# EAGLE design ethernet-cp2200 (EAGLE 7.4.0)
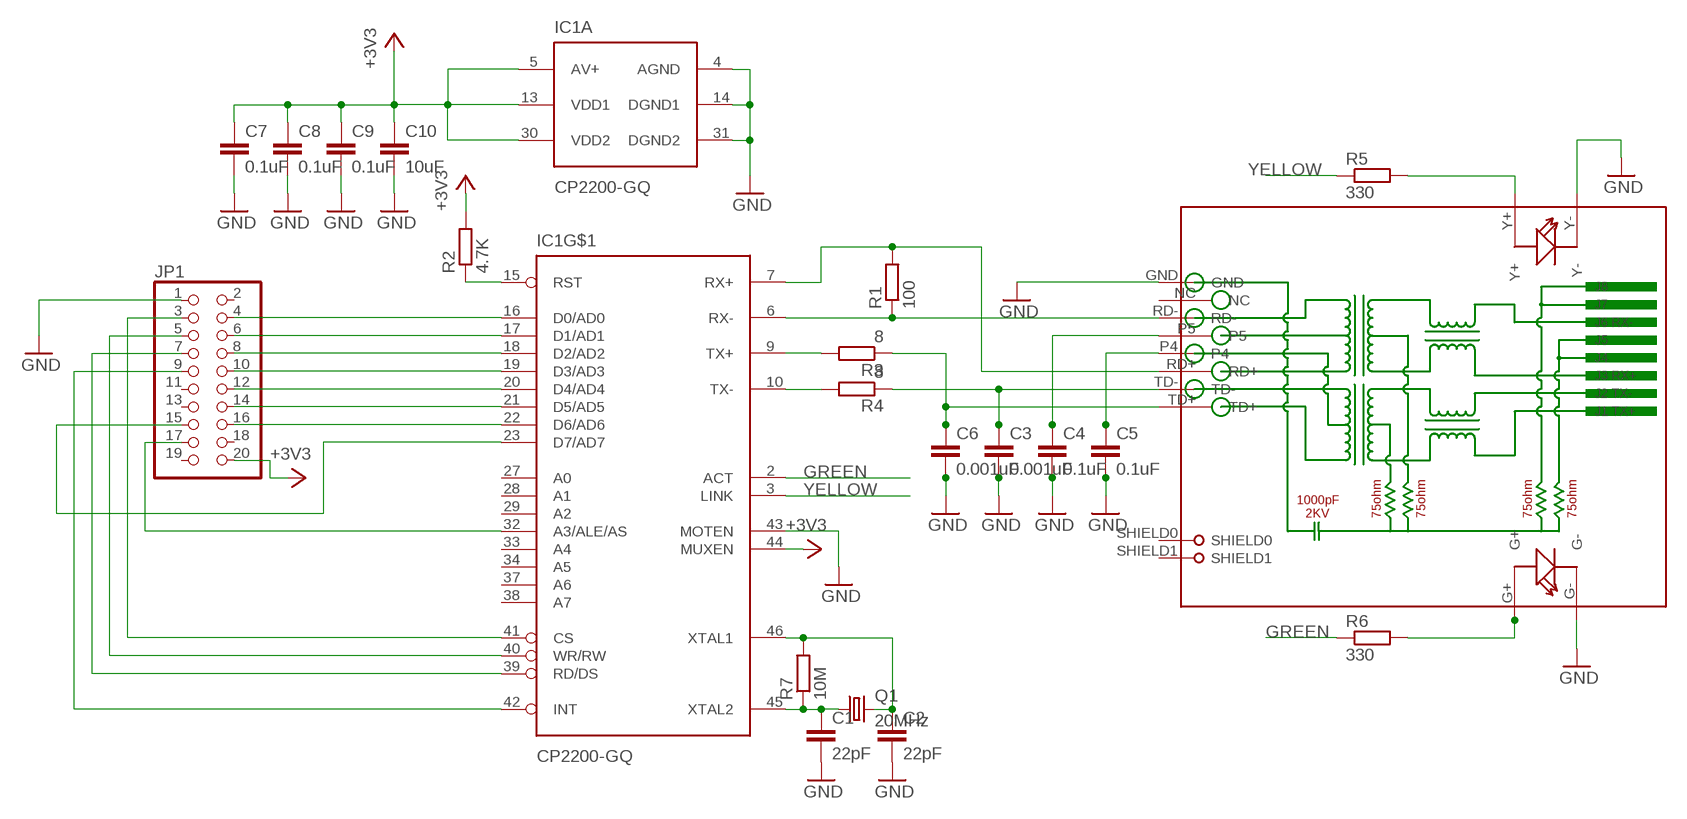
[diagram p0: schematic, sheet 1]

## Parts
C1  22pF  C-EUC0805  [C0805]
C2  22pF  C-EUC0805  [C0805]
C3  0.001uF  C-EUC0805  [C0805]
C4  0.1uF  C-EUC0805  [C0805]
C5  0.1uF  C-EUC0805  [C0805]
C6  0.001uF  C-EUC0805  [C0805]
C7  0.1uF  C-EUC0805  [C0805]
C8  0.1uF  C-EUC0805  [C0805]
C9  0.1uF  C-EUC0805  [C0805]
C10  10uF  C-EUC0805  [C0805]
IC1  CP2200-GQ  [TQFP-48]
JP1  PINHD-2X10  [2X10]
Q1  20MHz  CRYSTALHC49S  [HC49/S]
R1  100  R-EU_M0805  [M0805]
R2  4.7K  R-EU_M0805  [M0805]
R3  8  R-EU_M0805  [M0805]
R4  8  R-EU_M0805  [M0805]
R5  330  R-EU_M0805  [M0805]
R6  330  R-EU_M0805  [M0805]
R7  10M  R-EU_M0805  [M0805]
RJ1  HR911105A  [HR911105A]

## Nets
+3V3: C7.1 C8.1 C9.1 C10.1 IC1.5(A:AV+) IC1.13(A:VDD1) IC1.30(A:VDD2) IC1.44(MUXEN) JP1.20 R2.2
GND: C1.2 C2.2 C3.2 C4.2 C5.2 C6.2 C7.2 C8.2 C9.2 C10.2 IC1.4(A:AGND) IC1.14(A:DGND1) IC1.31(A:DGND2) IC1.43(MOTEN) JP1.1 RJ1.G- RJ1.GND RJ1.Y-
GREEN: IC1.2(ACT) R6.1
N$1: C2.1 IC1.46(XTAL1) Q1.2 R7.2
N$2: C1.1 IC1.45(XTAL2) Q1.1 R7.1
N$4: IC1.6(RX-) R1.1 RJ1.RD-
N$5: IC1.7(RX+) R1.2 RJ1.RD+
N$6: IC1.9(TX+) R3.2
N$7: C6.1 R3.1 RJ1.TD+
N$8: IC1.10(TX-) R4.2
N$9: R5.2 RJ1.Y+
N$10: R6.2 RJ1.G+
N$11: IC1.32(A3/ALE/AS) JP1.17
N$12: C3.1 R4.1 RJ1.TD-
N$13: IC1.16(D0/AD0) JP1.4
N$14: C5.1 RJ1.P4
N$15: C4.1 RJ1.P5
N$16: IC1.17(D1/AD1) JP1.6
N$18: IC1.18(D2/AD2) JP1.8
N$19: IC1.19(D3/AD3) JP1.10
N$20: IC1.20(D4/AD4) JP1.12
N$21: IC1.21(D5/AD5) JP1.14
N$22: IC1.22(D6/AD6) JP1.16
N$23: IC1.23(D7/AD7) JP1.15
N$25: IC1.41(CS) JP1.3
N$26: IC1.40(WR/RW) JP1.5
N$27: IC1.39(RD/DS) JP1.7
N$28: IC1.42(INT) JP1.9
N$29: IC1.15(RST) R2.1
YELLOW: IC1.3(LINK) R5.1
Unconnected: IC1.1(N:NC1) IC1.8(N:NC2) IC1.11(N:NC3) IC1.12(N:NC4) IC1.24(N:NC5) IC1.25(N:NC6) IC1.26(N:NC7) IC1.27(A0) IC1.28(A1) IC1.29(A2) IC1.33(A4) IC1.34(A5) IC1.35(N:NC8) IC1.36(N:NC9) IC1.37(A6) IC1.38(A7) IC1.47(N:NC10) IC1.48(N:NC11) JP1.2 JP1.11 JP1.13 JP1.18 JP1.19 RJ1.NC RJ1.SHIELD0 RJ1.SHIELD1

## Library data of the parts
C1-C10 = resistor:C-EU: CAPACITOR, European symbol
IC1 = silabs-eth:CP2200-GQ: SINGLE-CHIP ETHERNET CONTROLLER The CP2200 has an IEEE 802.3 compliant 10 BASE-T Ethernet
JP1 = SparkFun-Connectors:PINHD-2X10: PIN HEADER
Q1 = crystal:CRYSTAL: CRYSTAL; OC_FARNELL: 1667008; OC_NEWARK: unknown
R1-R7 = resistor:R-EU_: RESISTOR, European symbol
RJ1 = CONNECTER:HR911105A

## Board
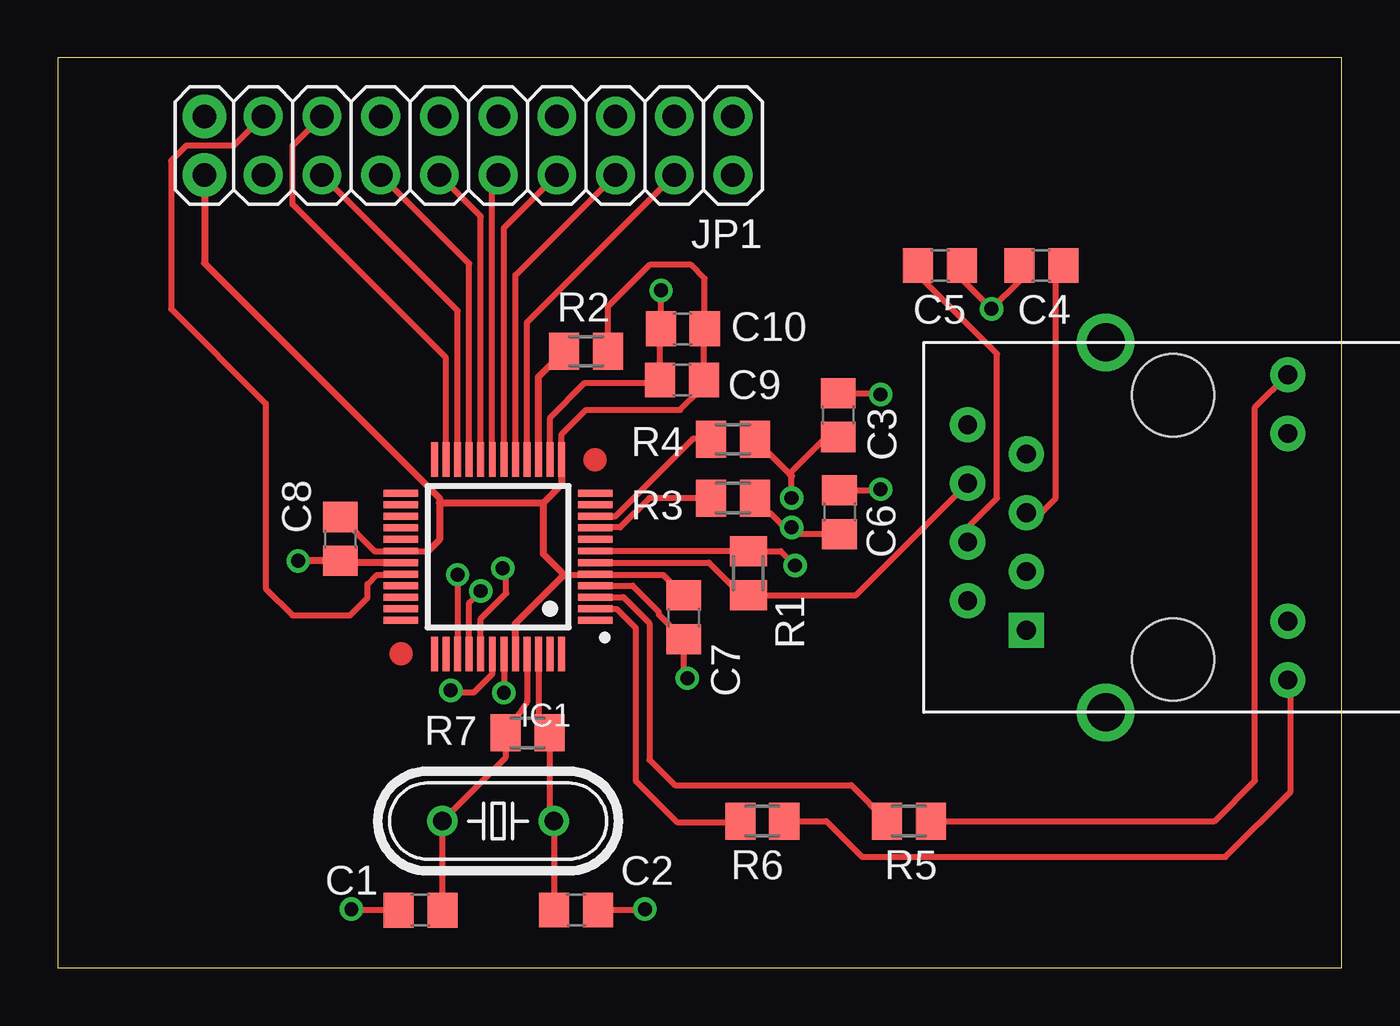
[diagram p1: board, top side]
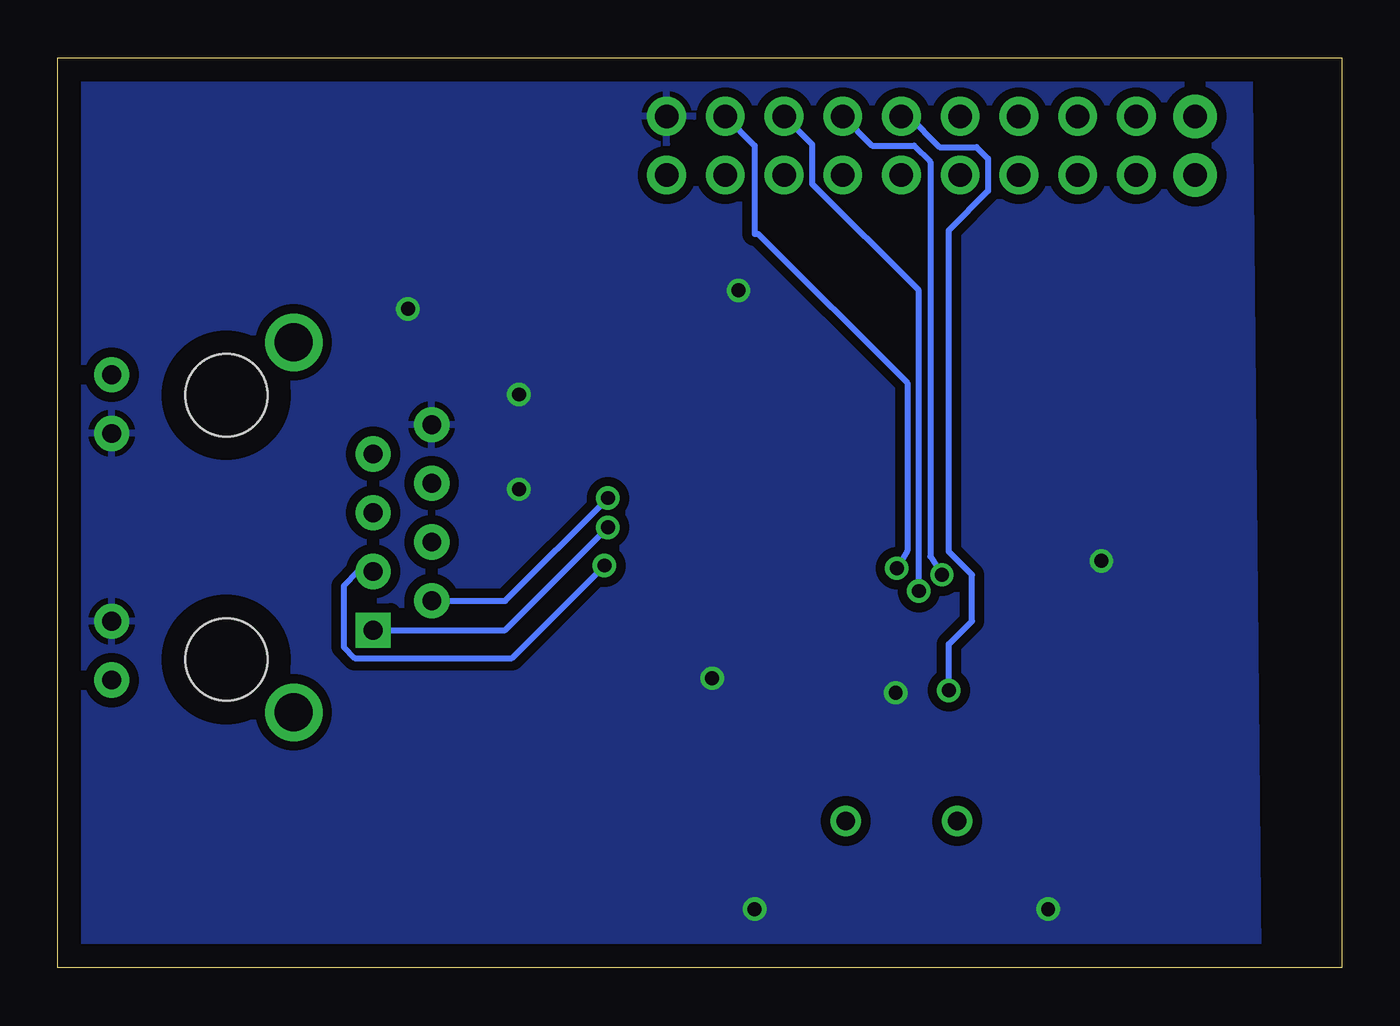
[diagram p2: board, bottom side, seen from below]

Size 55.55 x 39.36 mm. Coordinates in mm from the lower left corner, seen from the top.
Outline: 0,0 55.55,0 55.55,39.36 0,39.36 0,0
Copper layers (1*16): Top 0.035mm / dielectric 1.5mm / Bottom 0.035mm
Design rules "default": minimum track width 10mil, minimum drill 24mil, track to track 8mil, track to pad 8mil, pad to pad 8mil, via to via 8mil, smd to smd 8mil, copper to edge 40mil, drill to drill 8mil, minimum pad ring 10mil, minimum via ring 8mil, stop-mask expansion 4mil, vias tented up to drill 0mil, thermal gap 10mil

### Footprints (pad centres in the part's own frame; a part is rotated, then mirrored left to right if it is on the bottom)
C0805 = smd 1.3 x 1.5: 1 -0.95,0; 2 0.95,0
TQFP-48 = smd 1.5 x 0.3: 1 -4.2,2.75; 2 -4.2,2.25; 3 -4.2,1.75; 4 -4.2,1.25; 5 -4.2,0.75; 6 -4.2,0.25; 7 -4.2,-0.25; 8 -4.2,-0.75; 9 -4.2,-1.25; 10 -4.2,-1.75; 11 -4.2,-2.25; 12 -4.2,-2.75; 25 4.2,-2.75; 26 4.2,-2.25; 27 4.2,-1.75; 28 4.2,-1.25; 29 4.2,-0.75; 30 4.2,-0.25; 31 4.2,0.25; 32 4.2,0.75; 33 4.2,1.25; 34 4.2,1.75; 35 4.2,2.25; 36 4.2,2.75 | smd 0.3 x 1.5: 13 -2.75,-4.2; 14 -2.25,-4.2; 15 -1.75,-4.2; 16 -1.25,-4.2; 17 -0.75,-4.2; 18 -0.25,-4.2; 19 0.25,-4.2; 20 0.75,-4.2; 21 1.25,-4.2; 22 1.75,-4.2; 23 2.25,-4.2; 24 2.75,-4.2; 37 2.75,4.2; 38 2.25,4.2; 39 1.75,4.2; 40 1.25,4.2; 41 0.75,4.2; 42 0.25,4.2; 43 -0.25,4.2; 44 -0.75,4.2; 45 -1.25,4.2; 46 -1.75,4.2; 47 -2.25,4.2; 48 -2.75,4.2
2X10 = drill 1.016 pad 1.676: 1 -11.43,-1.27; 2 -11.43,1.27; 3 -8.89,-1.27; 4 -8.89,1.27; 5 -6.35,-1.27; 6 -6.35,1.27; 7 -3.81,-1.27; 8 -3.81,1.27; 9 -1.27,-1.27; 10 -1.27,1.27; 11 1.27,-1.27; 12 1.27,1.27; 13 3.81,-1.27; 14 3.81,1.27; 15 6.35,-1.27; 16 6.35,1.27; 17 8.89,-1.27; 18 8.89,1.27 | drill 1.016 pad 1.88: 19 11.43,-1.27; 20 11.43,1.27
HC49/S = drill 0.813: 1 -2.413,0; 2 2.413,0
M0805 = smd 1.3 x 1.6: 1 -0.95,0; 2 0.95,0
HR911105A = drill 0.813 pad 1.524: G+ 4.953,-6.604; G- 4.953,-4.064; GND -8.89,4.445; NC -6.35,3.175; P4 -8.89,-0.635; P5 -6.35,0.635; RD+ -6.35,-1.905; RD- -8.89,1.905; TD- -8.89,-3.175; Y+ 4.953,6.604; Y- 4.953,4.064 | drill 1.651 pad 2.159: SHIELD0 -2.921,8.001; SHIELD1 -2.921,-8.001 | drill 0.813 pad 1.524 square: TD+ -6.35,-4.445 | hole 3.556: 0,-5.715; 0,5.715

### Placement (x,y rotation side)
C1  15.69,2.5 180 top
C2  22.43,2.5 0 top
C3  33.76,23.91 90 top
C4  42.55,30.38 180 top
C5  38.17,30.38 0 top
C6  33.82,19.71 90 top
C7  27.08,15.16 270 top
C8  12.23,18.55 270 top
C9  27.02,25.43 180 top
C10  27.04,27.64 180 top
IC1  19.05,17.78 180 top
JP1  17.78,35.56 180 top
Q1  19.05,6.35 0 top
R1  29.88,17.07 90 top
R2  22.86,26.67 0 top
R3  29.21,20.32 180 top
R4  29.21,22.86 180 top
R5  36.83,6.35 0 top
R6  30.48,6.35 0 top
R7  20.32,10.16 0 top
RJ1  48.26,19.05 0 top

### Tracks (layer width: path | path; a pad name or v marks a point on that pad's centre or on a via)
+3V3
  Top 0.254: C7.1 26.19,17 23.28,17 IC1.5 23.22,17 21.9,17 | 16,18 14.88,18 IC1.30 14.82,18 13.73,18 C8.1 | IC1.13 21.8,23.07 22.86,24.13 26.93,24.13 27.8,25 27.8,25.27 C9.1 27.96,27.61 C10.1 27.99,29.81 27.4,30.4 25.6,30.4 23.81,28.61 R2.2
  Top 0.305: JP1.20 6.35,30.48 16.51,20.32 16.51,20.1 | 16.51,20.1 16.51,18.51 16,18 | IC1.13 21.8,20.9 21,20.1 | 21,20.1 16.51,20.1 | 21,20.1 21,17.9 21.9,17 19.8,14.9 IC1.44
GND  (via drill 0.6)
  Top 0.254: C1.2 12.74,2.5 | C2.2 25.36,2.5 | IC1.4 24.87,16.53 26,15.4 26,15.29 C7.2 27.08,12.69 | IC1.43 v19.3,11.9 | IC1.14 21.3,23.8 22.8,25.3 25.93,25.3 C9.2 26.07,27.61 C10.2 v26.09,29.29 v26.1,29.3 | C5.2 39.12,29.78 v40.4,28.5 41.6,29.7 C4.2 | C6.2 35.56,20.66 | C3.2 35.54,24.86
  Top 0.305: 12.74,2.5 v12.7,2.54 | 25.36,2.5 v25.4,2.54 | 27.08,12.69 v27.24,12.53 | IC1.31 12.3,17.53 C8.2 v10.4,17.6 | 35.56,20.66 v35.6,20.7 | 35.54,24.86 v35.6,24.8
  pour Bottom (isolate 0.406): 4,40.27 55,40.27 54.9,0.8 3.6,0.6
GREEN
  Top 0.254: IC1.2 24.17,15.53 25,14.7 25,8.1 26.8,6.3 29.48,6.3
  Top 0.305: 29.48,6.3 R6.1
N$1
  Top 0.254: C2.1 21.48,6.35 Q1.2 21.27,6.54 R7.2 | IC1.46 20.8,10.63
  Top 0.305: 20.8,10.63 R7.2
N$2
  Top 0.254: IC1.45 20.3,11.49 R7.1 19.37,9.08 Q1.1 C1.1
  Top 0.305: C1.1
N$4
  Top 0.254: IC1.6 28.17,17.53 29.3,16.4 | R1.1 34.53,16.12 RJ1.RD-
  Top 0.305: 29.3,16.4 29.6,16.4 R1.1
N$5  (via drill 0.6)
  Top 0.254: IC1.7 R1.2 | R1.2 31.28,18.02 v31.9,17.4
  Top 0.305: R1.2
  Bottom 0.254: RJ1.RD+ 42.55,17.14 43.18,16.51 43.18,13.88 42.7,13.4 35.9,13.4 v31.9,17.4
N$6
  Top 0.254: R3.2 25.6,20.32 24.33,19.05 23.27,19.05 IC1.9
N$7  (via drill 0.6)
  Top 0.254: 31.43,19.05 R3.1 | C6.1 32.04,18.76 v31.75,19.05
  Top 0.305: v31.75,19.05 31.43,19.05
  Bottom 0.254: RJ1.TD+ 36.2,14.61 v31.75,19.05
N$8
  Top 0.254: IC1.10 24.13,19.53 27.5,22.9 28.22,22.9 R4.2
N$9
  Top 0.254: R5.2 50.05,6.35 51.8,8.1 51.8,24.24 RJ1.Y+
N$10
  Top 0.254: R6.2 33.25,6.35 34.8,4.8 50.52,4.8 53.34,7.62 53.34,12.32 RJ1.G+
N$11
  Top 0.254: JP1.17 7.62,35.56 5.56,35.56 4.9,34.9 4.9,28.5 9,24.4 9,16.4 10.16,15.24 12.64,15.24 13.4,16 13.4,16.6 13.8,17 14.82,17 IC1.32
N$12  (via drill 0.6)
  Top 0.254: v31.75,20.32 31.75,21.27 | R4.1 31.66,21.36 33.26,22.96
  Top 0.305: 31.75,21.27 31.66,21.36 | C3.1 33.26,22.96
  Bottom 0.254: RJ1.TD- 36.2,15.88 v31.75,20.32
N$13
  Top 0.254: IC1.16 20.3,27.92 JP1.4
N$14
  Top 0.254: RJ1.P4 39.37,19.05 40.64,20.32 40.64,26.56 37.3,29.9
  Top 0.305: 37.3,29.9 37.3,30.3 C5.1
N$15
  Top 0.254: RJ1.P5 42.55,19.68 43.18,20.32 43.18,30.06
  Top 0.305: 43.18,30.06 C4.1
N$16
  Top 0.254: IC1.17 19.8,29.96 JP1.6
N$18
  Top 0.254: IC1.18 19.3,32 JP1.8
N$19
  Top 0.254: IC1.19 18.8,34.04 JP1.10
N$20
  Top 0.254: IC1.20 18.3,32.5 JP1.12
N$21
  Top 0.254: IC1.21 17.8,30.46 JP1.14
N$22
  Top 0.254: IC1.22 17.3,28.42 JP1.16
N$23
  Top 0.254: IC1.23 16.8,26.38 10.16,33.02 10.16,35.56 JP1.15
N$25  (via drill 0.6)
  Top 0.254: IC1.41 18.3,15.1 19.4,16.2 19.4,17.03 v19.25,17.28
  Bottom 0.254: JP1.3 25.4,35.56 25.4,31.75 25.25,31.75 18.8,25.3 18.8,18.03 v19.25,17.28
N$26  (via drill 0.6)
  Top 0.254: IC1.40 17.8,15.8 v18.3,16.3
  Bottom 0.254: v18.3,16.3 18.3,29.3 22.9,33.9 22.9,35.6 JP1.5
N$27  (via drill 0.6)
  Top 0.254: v17.3,17 IC1.39
  Bottom 0.254: v17.3,17 17.8,17.8 17.8,34.86 18.5,35.56 20.32,35.56 JP1.7
N$28  (via drill 0.6)
  Top 0.254: IC1.42 18.8,12.7 18,11.9 17.1,11.9 v17,12
  Bottom 0.254: v17,12 17,14 16,15 16,17 17,18 17,31.9 15.3,33.6 15.3,35 15.8,35.5 17.4,35.5 18.73,36.83 JP1.9
N$29
  Top 0.305: IC1.15 20.8,25.56 R2.1
YELLOW
  Top 0.254: IC1.3 24.47,16.03 25.6,14.9 25.6,9 26.7,7.9 34.33,7.9 R5.1